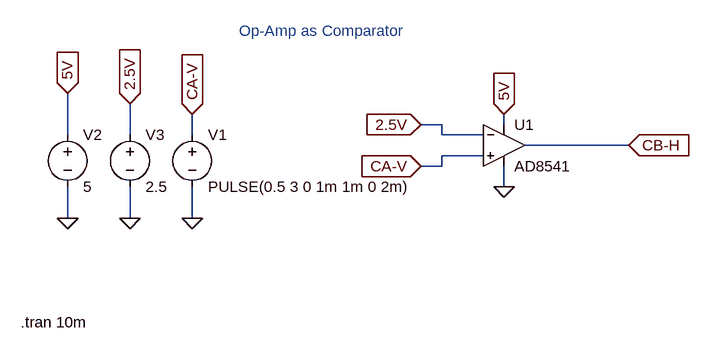
[diagram p0: schematic opamp_comp.asc]
opamp_comp.asc, the LTspice schematic file:
Version 4
SHEET 1 880 680
WIRE 368 96 336 96
WIRE 464 96 464 80
WIRE -208 112 -208 48
WIRE -112 112 -112 64
WIRE -16 112 -16 80
WIRE 368 112 368 96
WIRE 432 112 368 112
WIRE 656 128 496 128
WIRE 432 144 368 144
WIRE 368 160 368 144
WIRE 368 160 336 160
WIRE 464 192 464 160
WIRE -208 240 -208 192
WIRE -112 240 -112 192
WIRE -16 240 -16 192
FLAG -16 240 0
FLAG -208 240 0
FLAG -16 80 CA-V
IOPIN -16 80 In
FLAG 336 160 CA-V
IOPIN 336 160 In
FLAG -208 48 5V
IOPIN -208 48 In
FLAG 464 192 0
FLAG -112 240 0
FLAG -112 64 2.5V
IOPIN -112 64 In
FLAG 464 80 5V
IOPIN 464 80 In
FLAG 656 128 CB-H
IOPIN 656 128 In
FLAG 336 96 2.5V
IOPIN 336 96 In
SYMBOL Opamps\\AD8541 464 64 R0
SYMATTR InstName U1
SYMBOL voltage -16 96 R0
WINDOW 123 0 0 Left 0
WINDOW 39 0 0 Left 0
SYMATTR InstName V1
SYMATTR Value PULSE(0.5 3 0 1m 1m 0 2m)
SYMBOL voltage -208 96 R0
WINDOW 123 0 0 Left 0
WINDOW 39 0 0 Left 0
SYMATTR InstName V2
SYMATTR Value 5
SYMBOL voltage -112 96 R0
WINDOW 123 0 0 Left 0
WINDOW 39 0 0 Left 0
SYMATTR InstName V3
SYMATTR Value 2.5
TEXT -280 400 Left 2 !.tran 10m
TEXT 56 -48 Left 2 ;Op-Amp as Comparator

The netlist it stands for:
* opamp_comp.asc
XU1 CA-V 2.5V 5V 0 CB-H AD8541  ; pins In+ In- V+ V- OUT
V1 CA-V 0 PULSE(0.5 3 0 1m 1m 0 2m)
V2 5V 0 5
V3 2.5V 0 2.5
.tran 10m
* Op-Amp as Comparator
.backanno
.end